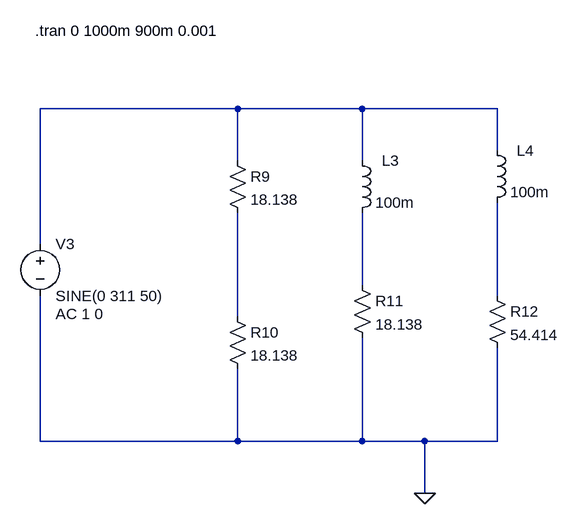
[diagram p0: schematic EJ7.asc]
EJ7.asc, the LTspice schematic file:
Version 4
SHEET 1 2744 1352
WIRE 1344 -64 1040 -64
WIRE 1536 -64 1344 -64
WIRE 1744 -64 1536 -64
WIRE 1744 0 1744 -64
WIRE 1344 16 1344 -64
WIRE 1536 16 1536 -64
WIRE 1040 144 1040 -64
WIRE 1536 208 1536 96
WIRE 1744 224 1744 80
WIRE 1344 256 1344 96
WIRE 1040 448 1040 224
WIRE 1344 448 1344 336
WIRE 1344 448 1040 448
WIRE 1536 448 1536 288
WIRE 1536 448 1344 448
WIRE 1632 448 1536 448
WIRE 1744 448 1744 304
WIRE 1744 448 1632 448
WIRE 1632 528 1632 448
FLAG 1632 528 0
SYMBOL voltage 1040 128 R0
WINDOW 123 24 124 Left 2
WINDOW 39 0 0 Left 0
SYMATTR Value2 AC 1 0
SYMATTR InstName V3
SYMATTR Value SINE(0 311 50)
SYMBOL res 1328 0 R0
SYMATTR InstName R9
SYMATTR Value 18.138
SYMBOL res 1328 240 R0
SYMATTR InstName R10
SYMATTR Value 18.138
SYMBOL res 1520 192 R0
SYMATTR InstName R11
SYMATTR Value 18.138
SYMBOL res 1728 208 R0
SYMATTR InstName R12
SYMATTR Value 54.414
SYMBOL ind 1520 0 R0
WINDOW 0 46 16 Left 2
SYMATTR InstName L3
SYMATTR Value 100m
SYMBOL ind 1728 -16 R0
WINDOW 0 46 16 Left 2
SYMATTR InstName L4
SYMATTR Value 100m
TEXT 1032 -184 Left 2 !.tran 0 1000m 900m 0.001

The netlist it stands for:
* EJ7.asc
V3 N001 0 SINE(0 311 50) AC 1 0
R9 N001 N004 18.138
R10 N004 0 18.138
R11 N002 0 18.138
R12 N003 0 54.414
L3 N001 N002 100m
L4 N001 N003 100m
.tran 0 1000m 900m 0.001
.backanno
.end